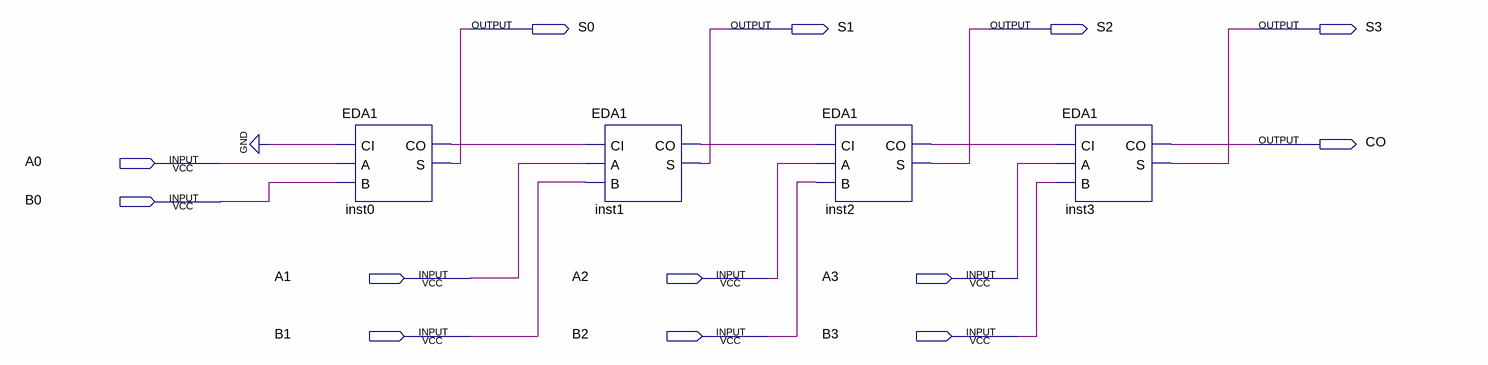
[diagram p0: schematic sheet]
// Quartus schematic CAL1.bdf as structural Verilog: 4 symbols, 13 pins
module CAL1 (
  input  A0,
  input  B0,
  input  A1,
  input  A2,
  input  A3,
  input  B1,
  input  B2,
  input  B3,
  output S0,
  output S1,
  output S2,
  output S3,
  output CO
);

  wire inst0_co, inst1_co, inst2_co;

  EDA1 inst0 (.CI(1'b0), .A(A0), .B(B0), .CO(inst0_co), .S(S0));
  EDA1 inst1 (.CI(inst0_co), .A(A1), .B(B1), .CO(inst1_co), .S(S1));
  EDA1 inst2 (.CI(inst1_co), .A(A2), .B(B2), .CO(inst2_co), .S(S2));
  EDA1 inst3 (.CI(inst2_co), .A(A3), .B(B3), .CO(CO), .S(S3));
endmodule
